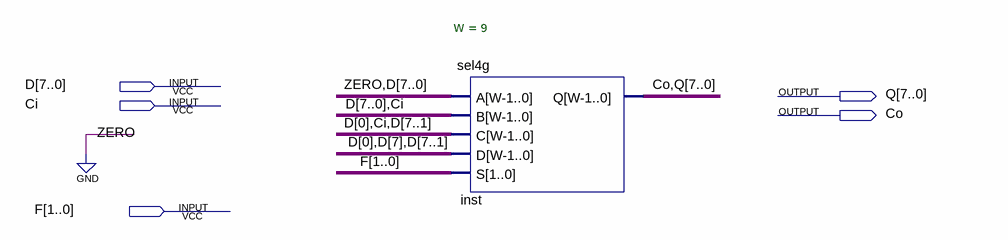
[diagram p0: schematic sheet]
// Quartus schematic sh1c.bdf as structural Verilog: 1 symbols, 5 pins
module sh1c (
  input  [7:0] D,
  input  Ci,
  input  [1:0] F,
  output [7:0] Q,
  output Co
);

  sel4g #(.W(9)) inst (
    .A({1'b0, D}), .B({D, Ci}), .C({D[0], Ci, D[7:1]}), .D({D[0], {2{D[7]}}, D[6:1]}), .S(F), .Q({Co, Q}));
endmodule
